# Altium schematic sheet Hplc103.SchDoc
size A2
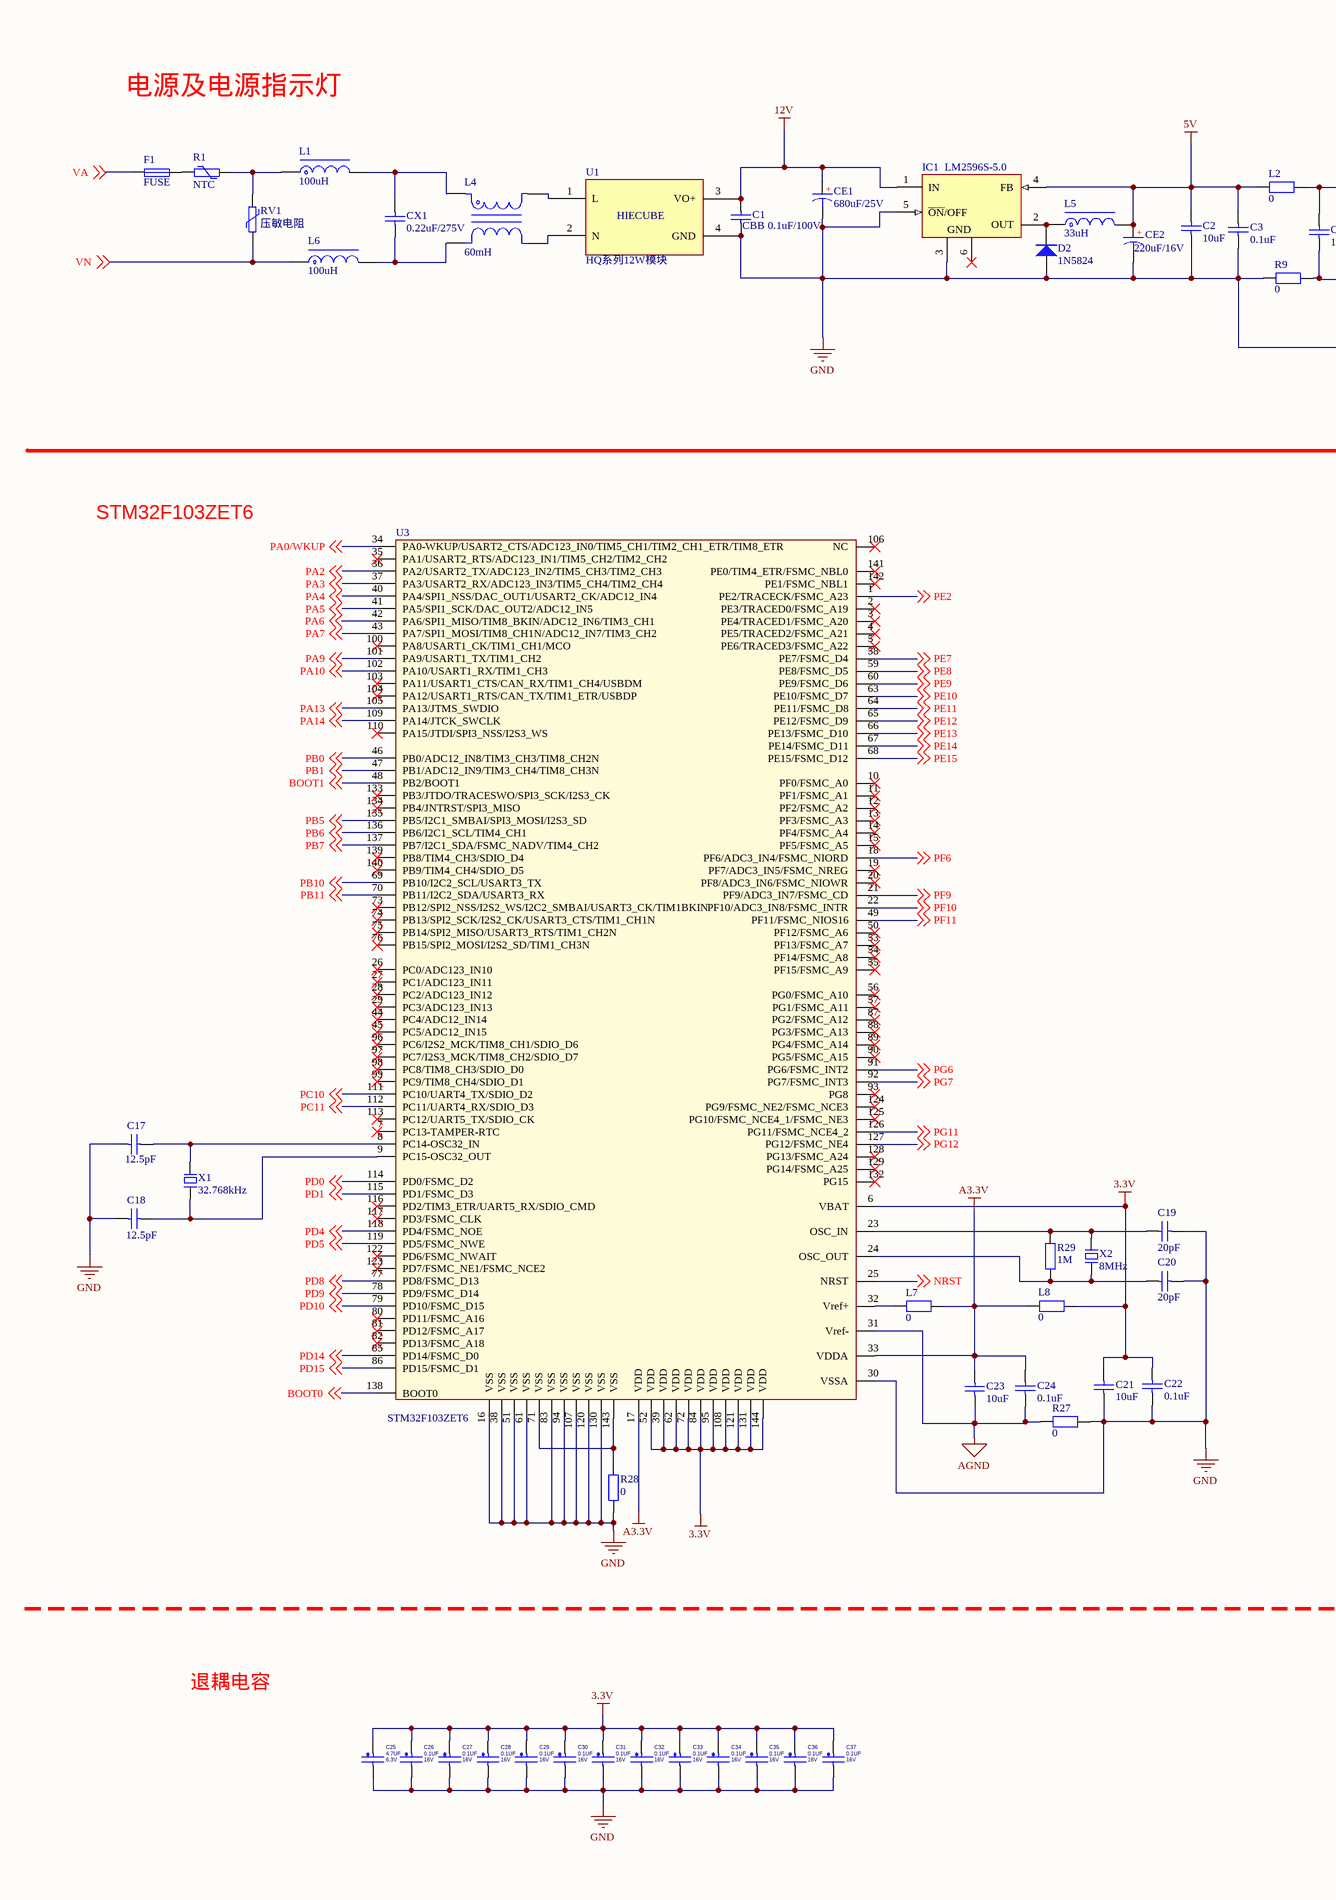
[diagram p0: Hplc103.SchDoc, left]
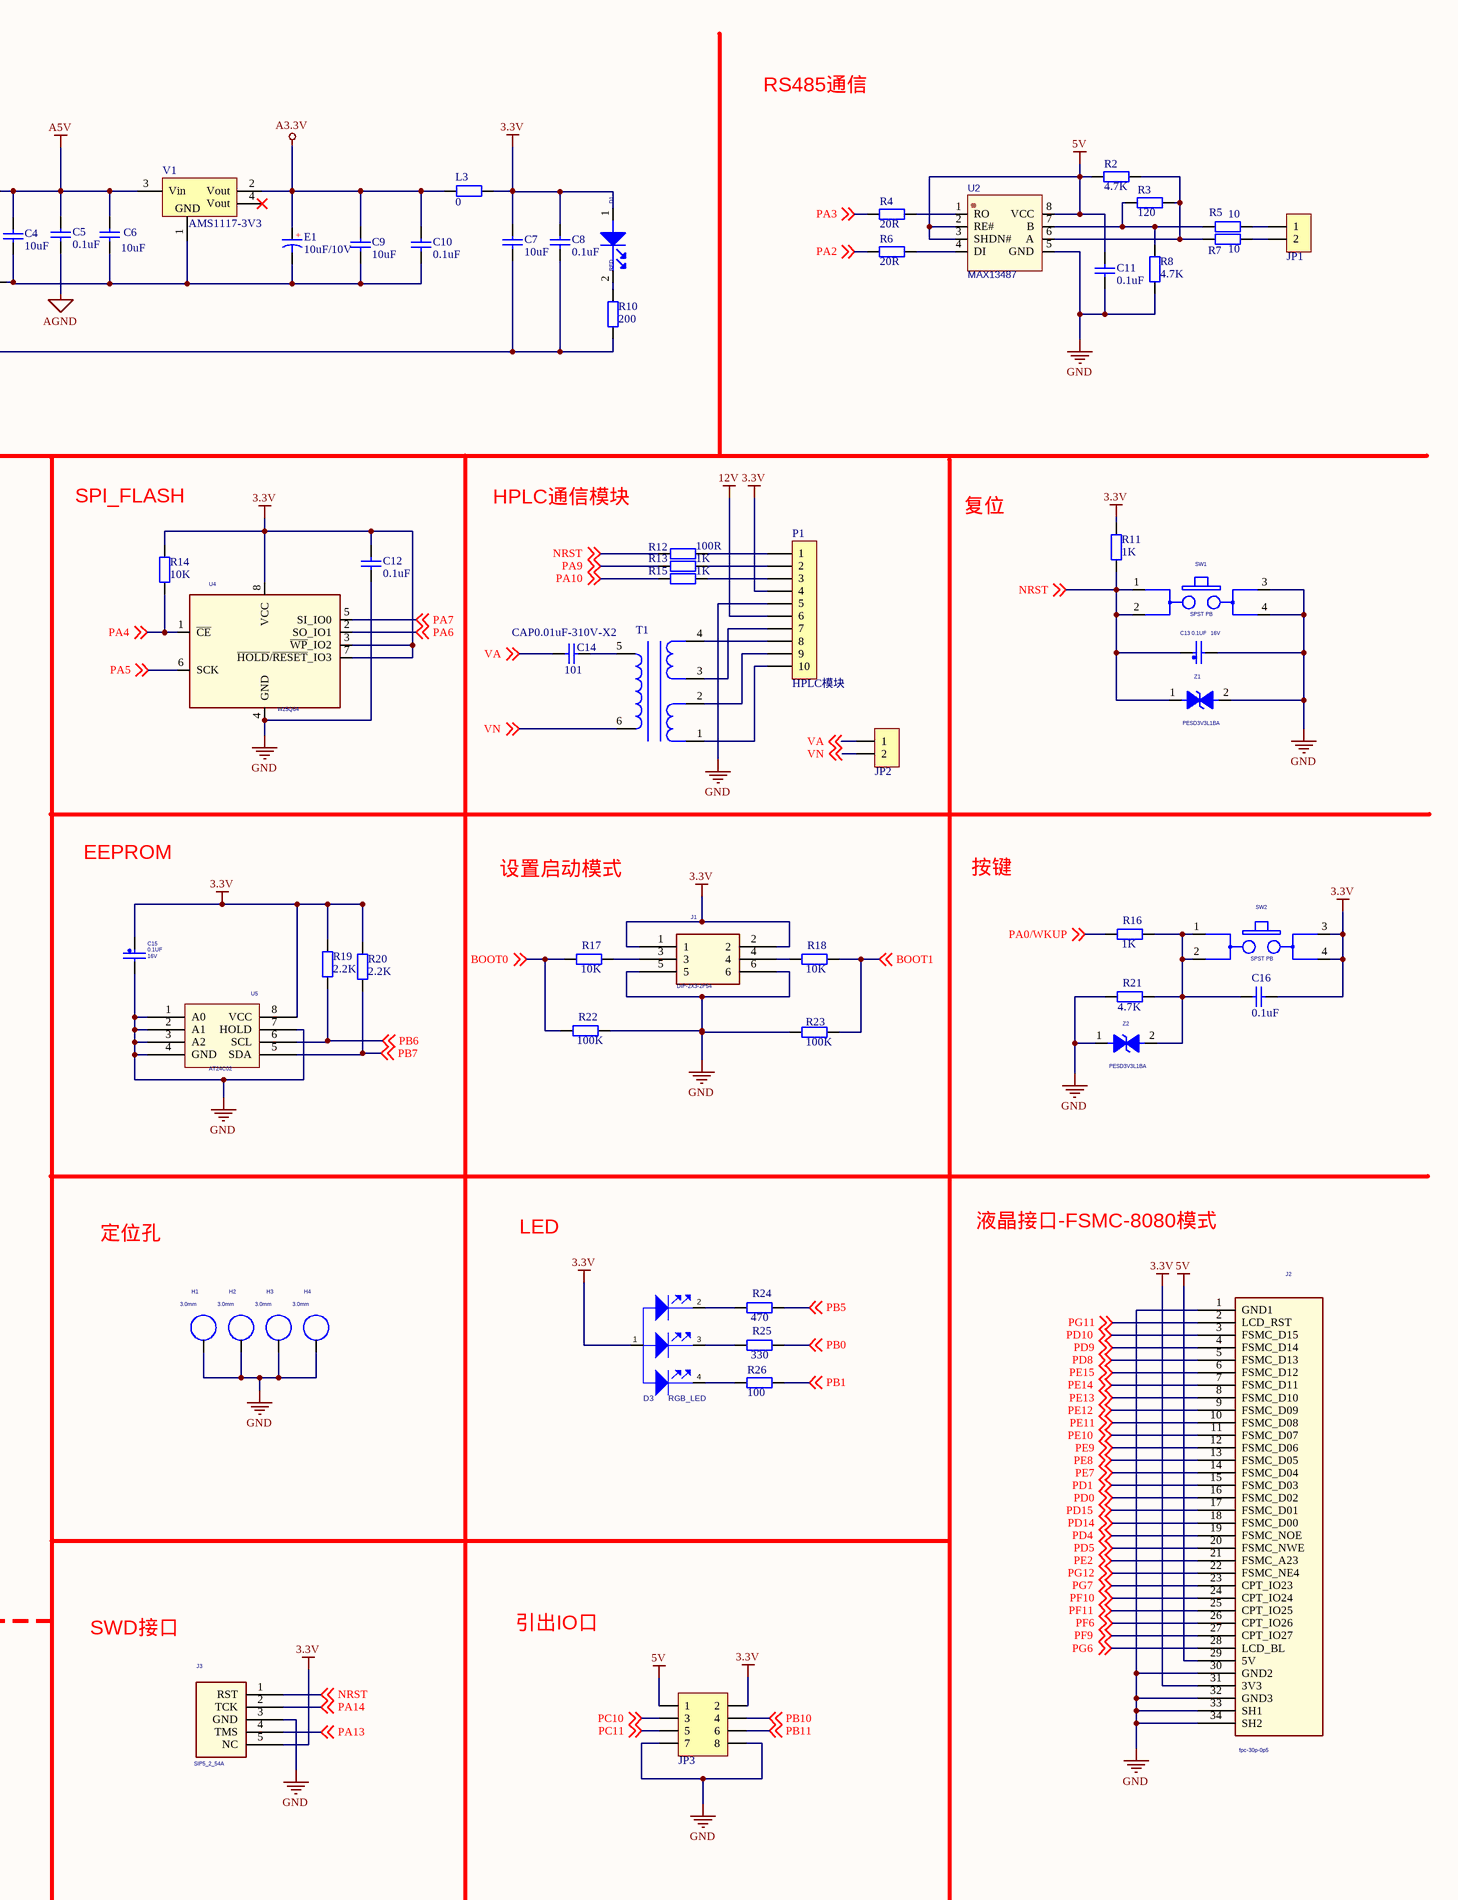
[diagram p1: Hplc103.SchDoc, right]

## Parts
C1  CBB 0.1uF/100V  [CBB 5*6.3*3]
C2  10uF  [C0805_M]
C3  0.1uF  [C0805_M]
C4  10uF  [C0805_M]
C5  0.1uF  [C0805_M]
C6  10uF  [C0805_M]
C7  10uF  [C0805_M]
C8  0.1uF  [C0805_M]
C9  10uF  [C0805_M]
C10  0.1uF  [C0805_M]
C11  0.1uF  [C0805_M]
C12  0.1uF  [C0805_M]
C13  0.1UF  voltage rating: 16V  [C0402]
C14  101  [CY 7.5*12*5]
C15  0.1UF  voltage rating: 16V  [C0402]
C16  0.1uF  [C0805_M]
C17  12.5pF  [C0805_M]
C18  12.5pF  [C0805_M]
C19  20pF  [C0805_M]
C20  20pF  [C0805_M]
C21  10uF  [C0805_M]
C22  0.1uF  [C0805_M]
C23  10uF  [C0805_M]
C24  0.1uF  [C0805_M]
C25  4.7UF  voltage rating: 6.3V  [C0603]
C26  0.1UF  voltage rating: 16V  [C0402]
C27  0.1UF  voltage rating: 16V  [C0402]
C28  0.1UF  voltage rating: 16V  [C0402]
C29  0.1UF  voltage rating: 16V  [C0402]
C30  0.1UF  voltage rating: 16V  [C0402]
C31  0.1UF  voltage rating: 16V  [C0402]
C32  0.1UF  voltage rating: 16V  [C0402]
C33  0.1UF  voltage rating: 16V  [C0402]
C34  0.1UF  voltage rating: 16V  [C0402]
C35  0.1UF  voltage rating: 16V  [C0402]
C36  0.1UF  voltage rating: 16V  [C0402]
C37  0.1UF  voltage rating: 16V  [C0402]
CE1  680uF/25V  [CAP 5.0*10*16 - GD]
CE2  220uF/16V  [CAP 2.5*6.3*7]
CX1  0.22uF/275V  [CX 10*13*11]
D1  RED  [LED0603]
D2  1N5824  [SMA]
D3  value RGB_LED  [LED_RGB_5MM]  (hidden comment: LED_1)
E1  10uF/10V  [C_3216]
F1  FUSE  [FUSE]
H1  3.0mm  [t3-5p5]
H2  3.0mm  [t3-5p5]
H3  3.0mm  [t3-5p5]
H4  3.0mm  [t3-5p5]
IC1  LM2596S-5.0  [TO263-5A]
J1  DIP-2X3-2P54  [DIP-2X3-2P54]
J2  fpc-30p-0p5  [fpc-32p-0p5]
J3  SIP5_2_54A  [SIP5-2P54]
JP1  HDR-1X2  [KF128-3.81-2P]  (value not drawn)
JP2  HDR-1X2  [2EHDVC]  (value not drawn)
JP3  Header 4X2  [CON20VP2R54-2X4TM]  (value not drawn)
L1  100uH  [CD54]
L2  0  [R0603]
L3  0  [R0603]
L4  60mH  [UU9.8]
L5  33uH  [CDRH127]
L6  100uH  [CD54]
L7  0  [R0603]
L8  0  [R0603]
P1  HPLC模块  [HDR2.0-M-LI-10P]
R1  NTC  [NTC]
R2  4.7K  [R0805_M]
R3  120  [R0805_M]
R4  20R  [R0805_M]
R5  10  [R0805_M]
R6  20R  [R0805_M]
R7  10  [R0805_M]
R8  4.7K  [R0805_M]
R9  0  [R0603]
R10  200  [R0805_M]
R11  1K  [R0805_M]
R12  100R  [R0805_M]
R13  1K  [R0805_M]
R14  10K  [R0805_M]
R15  1K  [R0805_M]
R16  1K  [R0805_M]
R17  10K  [R0805_M]
R18  10K  [R0805_M]
R19  2.2K  [R0805_M]
R20  2.2K  [R0805_M]
R21  4.7K  [R0805_M]
R22  100K  [R0805_M]
R23  100K  [R0805_M]
R24  470  [R0805_M]
R25  330  [R0805_M]
R26  100  [R0805_M]
R27  0  [R0603]
R28  0  [R0603]
R29  1M  [R0805_M]
RV1  压敏电阻  [TVR-14D]
SW1  SPST PB  [SW4_3X3P5]
SW2  SPST PB  [SW4_3X3P5]
T1  EPC17-5V  [HDR2&4]  (value not drawn)
U1  HQ系列12W模块  [12W单输出模块]
U2  MAX13487  [SOIC-8]
U3  STM32F103ZET6  [LQFP144-050]
U4  W25Q64  [SOIC8-208]
U5  AT24C02  [SOP8]
V1  AMS1117-3V3  [SOT223_M]
X1  32.768kHz  [OSC 3215-2P]
X2  8MHz  [OSC 5032-2P]
Z1  PESD3V3L1BA  [SOD323]
Z2  PESD3V3L1BA  [SOD323]

## Nets
3.3V: C7.2 C8.2 C12.1 C15.1 C16.2 C21.2 C22.2 C25.1 C26.1 C27.1 C28.1 C29.1 C30.1 C31.1 C32.1 C33.1 C34.1 C35.1 C36.1 C37.1 D1.1(ANODE) D3.1(ANODE) J1.1 J1.2 J2.31(3V3) J3.5(NC) JP3.2 L3.1 L8.1 P1.4 R11.2 R14.1 R19.1 R20.1 SW2.3(B1) SW2.4(B2) U3.6(VBAT) U3.39(VDD) U3.52(VDD) U3.62(VDD) U3.72(VDD) U3.84(VDD) U3.95(VDD) U3.108(VDD) U3.121(VDD) U3.131(VDD) U3.144(VDD) U4.3(~{WP}_IO2) U4.7(~{HOLD}/~{RESET}_IO3) U4.8(VCC) U5.8(VCC)
5V: C2.2 C3.2 C11.1 CE2.1 IC1.4(FB) J2.29(5V) JP3.1 L2.2 L5.2 R2.2 U2.2(RE#) U2.3(SHDN#) U2.8(VCC)
12V: C1.1 CE1.1 IC1.1(IN) P1.6 U1.3(VO+)
A3.3V: C9.2 C10.2 C23.2 C24.2 E1.1(A) L3.2 L7.1 L8.2 U3.17(VDD) U3.33(VDDA) V1.2(Vout)
A5V: C4.2 C5.2 C6.1 L2.1 V1.3(Vin)
AGND: C5.1 C23.1 C24.1 R27.1 U3.31(Vref-)
GND: C1.2 C2.1 C3.1 C7.1 C8.1 C11.2 C12.2 C13.2 C15.2 C17.1 C18.1 C19.1 C20.1 C21.1 C22.1 C25.2 C26.2 C27.2 C28.2 C29.2 C30.2 C31.2 C32.2 C33.2 C34.2 C35.2 C36.2 C37.2 CE1.2 CE2.2 D2.1(A) H1.1(NC_1) H2.1(NC_1) H3.1(NC_1) H4.1(NC_1) IC1.3(GND) IC1.5(~{ON}/OFF) J1.5 J1.6 J2.1(GND1) J2.30(GND2) J2.32(GND3) J2.33(SH1) J2.34(SH2) J3.3(GND) JP3.7 JP3.8 P1.5 R8.1 R9.2 R10.1 R21.1 R22.2 R23.1 R27.2 R28.2 SW1.3(B1) SW1.4(B2) U1.4(GND) U2.5(GND) U3.16(VSS) U3.30(VSSA) U3.38(VSS) U3.51(VSS) U3.61(VSS) U3.83(VSS) U3.94(VSS) U3.107(VSS) U3.120(VSS) U3.130(VSS) U4.4(GND) U5.1(A0) U5.2(A1) U5.3(A2) U5.4(GND) U5.7(HOLD) Z1.2 Z2.1
BOOT0: R17.1 R22.1 U3.138(BOOT0) ; off-sheet BOOT0
BOOT1: R18.2 R23.2 U3.48(PB2/BOOT1) ; off-sheet BOOT1
NRST: C13.1 J3.1(RST) R11.1 R12.1 SW1.1(A1) SW1.2(A2) U3.25(NRST) Z1.1 ; off-sheet NRST
PA0/WKUP: R16.1 U3.34(PA0-WKUP/USART2_CTS/ADC123_IN0/TIM5_CH1/TIM2_CH1_ETR/TIM8_ETR) ; off-sheet PA0/WKUP
PA2: R6.1 U3.36(PA2/USART2_TX/ADC123_IN2/TIM5_CH3/TIM2_CH3) ; off-sheet PA2
PA3: R4.1 U3.37(PA3/USART2_RX/ADC123_IN3/TIM5_CH4/TIM2_CH4) ; off-sheet PA3
PA4: R14.2 U3.40(PA4/SPI1_NSS/DAC_OUT1/USART2_CK/ADC12_IN4) U4.1(~{CE}) ; off-sheet PA4
PA5: U3.41(PA5/SPI1_SCK/DAC_OUT2/ADC12_IN5) U4.6(SCK) ; off-sheet PA5
PA6: U3.42(PA6/SPI1_MISO/TIM8_BKIN/ADC12_IN6/TIM3_CH1) U4.2(SO_IO1) ; off-sheet PA6
PA7: U3.43(PA7/SPI1_MOSI/TIM8_CH1N/ADC12_IN7/TIM3_CH2) U4.5(SI_IO0) ; off-sheet PA7
PA9: R13.1 U3.101(PA9/USART1_TX/TIM1_CH2) ; off-sheet PA9
PA10: R15.1 U3.102(PA10/USART1_RX/TIM1_CH3) ; off-sheet PA10
PA13: J3.4(TMS) U3.105(PA13/JTMS_SWDIO) ; off-sheet PA13
PA14: J3.2(TCK) U3.109(PA14/JTCK_SWCLK) ; off-sheet PA14
PB0: R25.2 U3.46(PB0/ADC12_IN8/TIM3_CH3/TIM8_CH2N) ; off-sheet PB0
PB1: R26.1 U3.47(PB1/ADC12_IN9/TIM3_CH4/TIM8_CH3N) ; off-sheet PB1
PB5: R24.2 U3.135(PB5/I2C1_SMBAI/SPI3_MOSI/I2S3_SD) ; off-sheet PB5
PB6: R19.2 U3.136(PB6/I2C1_SCL/TIM4_CH1) U5.6(SCL) ; off-sheet PB6
PB7: R20.2 U3.137(PB7/I2C1_SDA/FSMC_NADV/TIM4_CH2) U5.5(SDA) ; off-sheet PB7
PB10: JP3.4 U3.69(PB10/I2C2_SCL/USART3_TX) ; off-sheet PB10
PB11: JP3.6 U3.70(PB11/I2C2_SDA/USART3_RX) ; off-sheet PB11
PC10: JP3.3 U3.111(PC10/UART4_TX/SDIO_D2) ; off-sheet PC10
PC11: JP3.5 U3.112(PC11/UART4_RX/SDIO_D3) ; off-sheet PC11
PD0: J2.16(FSMC_D02) U3.114(PD0/FSMC_D2) ; off-sheet PD0
PD1: J2.15(FSMC_D03) U3.115(PD1/FSMC_D3) ; off-sheet PD1
PD4: J2.19(FSMC_NOE) U3.118(PD4/FSMC_NOE) ; off-sheet PD4
PD5: J2.20(FSMC_NWE) U3.119(PD5/FSMC_NWE) ; off-sheet PD5
PD8: J2.5(FSMC_D13) U3.77(PD8/FSMC_D13) ; off-sheet PD8
PD9: J2.4(FSMC_D14) U3.78(PD9/FSMC_D14) ; off-sheet PD9
PD10: J2.3(FSMC_D15) U3.79(PD10/FSMC_D15) ; off-sheet PD10
PD14: J2.18(FSMC_D00) U3.85(PD14/FSMC_D0) ; off-sheet PD14
PD15: J2.17(FSMC_D01) U3.86(PD15/FSMC_D1) ; off-sheet PD15
PE2: J2.21(FSMC_A23) U3.1(PE2/TRACECK/FSMC_A23) ; off-sheet PE2
PE7: J2.14(FSMC_D04) U3.58(PE7/FSMC_D4) ; off-sheet PE7
PE8: J2.13(FSMC_D05) U3.59(PE8/FSMC_D5) ; off-sheet PE8
PE9: J2.12(FSMC_D06) U3.60(PE9/FSMC_D6) ; off-sheet PE9
PE10: J2.11(FSMC_D07) U3.63(PE10/FSMC_D7) ; off-sheet PE10
PE11: J2.10(FSMC_D08) U3.64(PE11/FSMC_D8) ; off-sheet PE11
PE12: J2.9(FSMC_D09) U3.65(PE12/FSMC_D9) ; off-sheet PE12
PE13: J2.8(FSMC_D10) U3.66(PE13/FSMC_D10) ; off-sheet PE13
PE14: J2.7(FSMC_D11) U3.67(PE14/FSMC_D11) ; off-sheet PE14
PE15: J2.6(FSMC_D12) U3.68(PE15/FSMC_D12) ; off-sheet PE15
PF6: J2.26(CPT_IO26) U3.18(PF6/ADC3_IN4/FSMC_NIORD) ; off-sheet PF6
PF9: J2.27(CPT_IO27) U3.21(PF9/ADC3_IN7/FSMC_CD) ; off-sheet PF9
PF10: J2.24(CPT_IO24) U3.22(PF10/ADC3_IN8/FSMC_INTR) ; off-sheet PF10
PF11: J2.25(CPT_IO25) U3.49(PF11/FSMC_NIOS16) ; off-sheet PF11
PG6: J2.28(LCD_BL) U3.91(PG6/FSMC_INT2) ; off-sheet PG6
PG7: J2.23(CPT_IO23) U3.92(PG7/FSMC_INT3) ; off-sheet PG7
PG11: J2.2(LCD_RST) U3.126(PG11/FSMC_NCE4_2) ; off-sheet PG11
PG12: J2.22(FSMC_NE4) U3.127(PG12/FSMC_NE4) ; off-sheet PG12
VA: C14.1 F1.1 JP2.1 ; off-sheet VA
VN: JP2.2 L6.1 RV1.1 T1.6 ; off-sheet VN
NetC4_1: C4.1 C6.2 C9.1 C10.1 E1.2(K) R9.1 V1.1(GND)
NetC14_2: C14.2 T1.5
NetC16_1: C16.1 R16.2 R21.2 SW2.1(A1) SW2.2(A2) Z2.2
NetC17_2: C17.2 U3.8(PC14-OSC32_IN) X1.2
NetC18_2: C18.2 U3.9(PC15-OSC32_OUT) X1.1
NetC19_2: C19.2 R29.2 U3.23(OSC_IN) X2.1
NetC20_2: C20.2 R29.1 U3.24(OSC_OUT) X2.2
NetCX1_1: CX1.1 L4.4 L6.2
NetCX1_2: CX1.2 L1.2 L4.1
NetD1_2: D1.2(CATHODE) R10.2
NetD2_2: D2.2(K) IC1.2(OUT) L5.1
NetD3_2: D3.2(R) R24.1
NetD3_3: D3.3(G) R25.1
NetD3_4: D3.4(B) R26.2
NetF1_2: F1.2 R1.1
NetJ1_3: J1.3 R17.2
NetJ1_4: J1.4 R18.1
NetJP1_1: JP1.1 R5.2
NetJP1_2: JP1.2 R7.2
NetL1_1: L1.1 R1.2 RV1.2
NetL4_2: L4.2 U1.1(L)
NetL4_3: L4.3 U1.2(N)
NetL7_2: L7.2 U3.32(Vref+)
NetP1_1: P1.1 R12.2
NetP1_2: P1.2 R13.2
NetP1_3: P1.3 R15.2
NetP1_7: P1.7 T1.3
NetP1_8: P1.8 T1.4
NetP1_9: P1.9 T1.2
NetP1_10: P1.10 T1.1
NetR2_1: R2.1 R3.1 R7.1 U2.6(A)
NetR3_2: R3.2 R5.1 R8.2 U2.7(B)
NetR4_2: R4.2 U2.1(RO)
NetR6_2: R6.2 U2.4(DI)
NetR28_1: R28.1 U3.71(VSS) U3.143(VSS)

Not connected (* = marked no-connect by the designer): IC1 6(GND)*; U3 2(PE3/TRACED0/FSMC_A19)* 3(PE4/TRACED1/FSMC_A20)* 4(PE5/TRACED2/FSMC_A21)* 5(PE6/TRACED3/FSMC_A22)* 7(PC13-TAMPER-RTC)* 10(PF0/FSMC_A0)* 11(PF1/FSMC_A1)* 12(PF2/FSMC_A2)* 13(PF3/FSMC_A3)* 14(PF4/FSMC_A4)* 15(PF5/FSMC_A5)* 19(PF7/ADC3_IN5/FSMC_NREG)* 20(PF8/ADC3_IN6/FSMC_NIOWR)* 26(PC0/ADC123_IN10)* 27(PC1/ADC123_IN11)* 28(PC2/ADC123_IN12)* 29(PC3/ADC123_IN13)* 35(PA1/USART2_RTS/ADC123_IN1/TIM5_CH2/TIM2_CH2)* 44(PC4/ADC12_IN14)* 45(PC5/ADC12_IN15)* 50(PF12/FSMC_A6)* 53(PF13/FSMC_A7)* 54(PF14/FSMC_A8)* 55(PF15/FSMC_A9)* 56(PG0/FSMC_A10)* 57(PG1/FSMC_A11)* 73(PB12/SPI2_NSS/I2S2_WS/I2C2_SMBAI/USART3_CK/TIM1BKIN)* 74(PB13/SPI2_SCK/I2S2_CK/USART3_CTS/TIM1_CH1N)* 75(PB14/SPI2_MISO/USART3_RTS/TIM1_CH2N)* 76(PB15/SPI2_MOSI/I2S2_SD/TIM1_CH3N)* 80(PD11/FSMC_A16)* 81(PD12/FSMC_A17)* 82(PD13/FSMC_A18)* 87(PG2/FSMC_A12)* 88(PG3/FSMC_A13)* 89(PG4/FSMC_A14)* 90(PG5/FSMC_A15)* 93(PG8)* 96(PC6/I2S2_MCK/TIM8_CH1/SDIO_D6)* 97(PC7/I2S3_MCK/TIM8_CH2/SDIO_D7)* 98(PC8/TIM8_CH3/SDIO_D0)* 99(PC9/TIM8_CH4/SDIO_D1)* 100(PA8/USART1_CK/TIM1_CH1/MCO)* 103(PA11/USART1_CTS/CAN_RX/TIM1_CH4/USBDM)* 104(PA12/USART1_RTS/CAN_TX/TIM1_ETR/USBDP)* 106(NC)* 110(PA15/JTDI/SPI3_NSS/I2S3_WS)* 113(PC12/UART5_TX/SDIO_CK)* 116(PD2/TIM3_ETR/UART5_RX/SDIO_CMD)* 117(PD3/FSMC_CLK)* 122(PD6/FSMC_NWAIT)* 123(PD7/FSMC_NE1/FSMC_NCE2)* 124(PG9/FSMC_NE2/FSMC_NCE3)* 125(PG10/FSMC_NCE4_1/FSMC_NE3)* 128(PG13/FSMC_A24)* 129(PG14/FSMC_A25)* 132(PG15)* 133(PB3/JTDO/TRACESWO/SPI3_SCK/I2S3_CK)* 134(PB4/JNTRST/SPI3_MISO)* 139(PB8/TIM4_CH3/SDIO_D4)* 140(PB9/TIM4_CH4/SDIO_D5)* 141(PE0/TIM4_ETR/FSMC_NBL0)* 142(PE1/FSMC_NBL1)*; V1 4(Vout)*

## Notes on the sheet
- 电源及电源指示灯
- RS485通信
- STM32F103ZET6
- (near R14) SPI_FLASH
- HPLC通信模块
- 复位
- EEPROM
- 设置启动模式
- 按键
- LED
- 液晶接口-FSMC-8080模式
- 定位孔
- SWD接口
- 引出IO口
- 退耦电容
- (in symbol CE) +
- (in symbol CT) +
- (in symbol HQ系列12W模块) HIECUBE
- (in symbol 电容) CAP0.01uF-310V-X2

## Library data of the parts
C1 = CBB: CBB电容; 联系卖家，免费查找封装: 唯一出售店铺网址https://shop463601444.taobao.com; 封装库来自淘宝卖家ID：黄晶宝石: 其他店铺购入均为盗版假冒封装库，请立即申请退款; BOM名称: CBB电容
C2-C12 C16-C24 = C: 贴片电容; BOM名称: 无极性贴片电容; 联系卖家，免费查找封装: 唯一出售店铺网址https://shop463601444.taobao.com; 封装库来自淘宝卖家ID：黄晶宝石: 其他店铺购入均为盗版假冒封装库，请立即申请退款
C13 C25-C37 = CAP_NP: CAP CER 22UF 6.3V 20% X5R 0603; CLASS: DISCRETE; AGILE_PN: 150-78467; MFG_NAME01: Samsung; MFG_PN01: CL10A226MQ8NRNE; CAD_APPROVED: Yes; FPLIST: CC0603_OV,CC0603,0603_CC; Tolerance: 20%; ROHS: Yes; HEIGHT: 1MM; VOLTAGE: 6.3V
C14 = 电容
C15 = CAP_NP: CAP CER 22UF 6.3V 20% X5R 0402; CLASS: DISCRETE; AGILE_PN: 150-78467; MFG_NAME01: Samsung; MFG_PN01: CL10A226MQ8NRNE; CAD_APPROVED: Yes; FPLIST: CC0603_OV,CC0603,0603_CC; Tolerance: 20%; ROHS: Yes; HEIGHT: 1MM; VOLTAGE: 6.3V
CE1 CE2 = CE: 直插电解电容; 联系卖家，免费查找封装: 唯一出售店铺网址https://shop463601444.taobao.com; 封装库来自淘宝卖家ID：黄晶宝石: 其他店铺购入均为盗版假冒封装库，请立即申请退款; BOM名称: 直插电解电容
CX1 = CX: 安规X电容; BOM名称: X电容; 联系卖家，免费查找封装: 唯一出售店铺网址https://shop463601444.taobao.com; 封装库来自淘宝卖家ID：黄晶宝石: 其他店铺购入均为盗版假冒封装库，请立即申请退款
D1 = LED_0: CLASS: IC
D2 = 1N5822: 肖特基二极管; 联系卖家，免费查找封装: 唯一出售店铺网址https://shop463601444.taobao.com; BOM名称: 肖特基二极管
D3 = LED_1: LED GRN SGL 25MA 0603; CAD_APPROVED: Yes; MFG_PN01: KPT-1608SGC; MFG_NAME01: KINGBRIGHT; AGILE_PN: 370-76549; Source_Path: F:\STM32\F429\PCB\V4\F429\F429_F767_H743MB\STM32F429_F767_H743_MB_1203.DSN; CLASS: IC; HEIGHT: 0.85MM; ROHS: Yes; PCB DECAL: LED_RGB_5MM
E1 = CT: 贴片钽电容; 联系卖家，免费查找封装: 唯一出售店铺网址https://shop463601444.taobao.com; 封装库来自淘宝卖家ID：黄晶宝石: 其他店铺购入均为盗版假冒封装库，请立即申请退款; BOM名称: 贴片钽电容
H1-H4 = SPACER_0: FASTENER, STANDOFF 4.5MMX3.53XM3.0X0.5 ROUND THR .635"L BRASS; CLASS: IC; CAD_APPROVED: Yes; ASSY_OPT: DNP; MFG_PN01: MSS251-R-1-A-16; MFG_NAME01: UNICORP; AGILE_PN: 280-76498; HEIGHT: 16.13MM; ROHS: Yes
IC1 = LM2596S: 3A DC-DC降压芯片; BOM名称: DC降压芯片; 封装库来自淘宝卖家 ID：黄晶宝石: 其他店铺购入均为盗版，请立即申请退款，本店现金奖励5~20元; 联系卖家 免费查找封装: 唯一出售店铺网址https://shop463601444.taobao.com
J1 = 2X4_2
J2 = CON30_2
J3 = SIP5_2_0
JP1 JP2 = Header 2: 2P接插件; 联系卖家，免费技术支持: 唯一出售店铺网址https://shop463601444.taobao.com; BOM名称: 2P接插件
JP3 = Header 4X2: 4*2P接插件; 版权归属: 源创客; BOM名称: 4*2P接插件; 学习资源: www.ooocke.com
L1 L6 = L-SMD: CD系列贴片线绕功率电感; BOM名称: 功率电感; 联系卖家，免费查找封装: 唯一出售店铺网址https://shop463601444.taobao.com; 封装库来自淘宝卖家ID：黄晶宝石: 其他店铺购入均为盗版假冒封装库，请立即申请退款
L2 L3 L7 L8 R9 R27-R29 = R: 贴片电阻; 联系卖家，免费查找封装: 唯一出售店铺网址https://shop463601444.taobao.com; 封装库来自淘宝卖家ID：黄晶宝石: 其他店铺购入均为盗版假冒封装库，请立即申请退款; BOM名称: 贴片电阻
L4 = L-UU: 共模电感; 联系卖家，免费查找封装: 唯一出售店铺网址https://shop463601444.taobao.com; 封装库来自淘宝卖家ID：黄晶宝石: 其他店铺购入均为盗版假冒封装库，请立即申请退款; BOM名称: 共模电感
L5 = L-CDRH: CDRH功率屏蔽电感; BOM名称: 功率屏蔽电感; 联系卖家，免费查找封装: 唯一出售店铺网址https://shop463601444.taobao.com; 封装库来自淘宝卖家ID：黄晶宝石: 其他店铺购入均为盗版假冒封装库，请立即申请退款
P1 = pin1*10（小）
R2-R8 R10 R11 R14 R16-R26 = Res_1
R12 R13 R15 = 电阻
SW1 SW2 = SW_PB_ESW_0: SW SPST MOM NO PB TACT 50mA 50V SMT; CLASS: IC; AGILE_PN: 510-77562; MFG_NAME01: E SWITCH; MFG_PN01: TL3301AF260QG/TR; CAD_APPROVED: Yes; ROHS: Yes; HEIGHT: 5MM
T1 = EPC17-5V: 12V 高频变压器; 版权归属: 源创客; ROM名称: 12V 高频变压器; 学习资源: www.ooocke.com
U2 = MAX13487: BOM_Manufacturer Part: MAX13487EESA; 封装库来自淘宝卖家 ID：黄晶宝石: 其他店铺购入均为假冒，请立即申请退款，本店现金奖励
U4 = 25WP_2: IC MEM FLASH QPI 64Mb 1.65-1.95V SOIC8W; CAD_APPROVED: Yes; Temp_Range: -40C to +105C; MFG_PN01: IS25WP064A-JBLE; MFG_NAME01: ISSI; AGILE_PN: 334-77734; CLASS: IC; HEIGHT: 2.16MM; ROHS: Yes
U5 = AT24C02_0: OriginalSymbolOrigin: (-20000,30000)
V1 = AMS1117: 三端稳压芯片; BOM名称: 稳压芯片; 封装库来自淘宝卖家 ID：黄晶宝石: 其他店铺购入均为盗版，请立即申请退款，本店现金奖励5~20元; 联系卖家 免费查找封装: 唯一出售店铺网址https://shop463601444.taobao.com
X1 X2 = XTAL-2P: 2脚无源脚晶振; 联系卖家，免费查找封装: 唯一出售店铺网址https://shop463601444.taobao.com; BOM名称: 2脚无源脚晶振
Z1 Z2 = DIODE BI-DIR TRIG: Assembly: NC; ROOM: B-VGA_IN; Package: D0603